# Altium schematic sheet LT5512.SchDoc
size A2; SheetNumber: 1; SheetTotal: 1
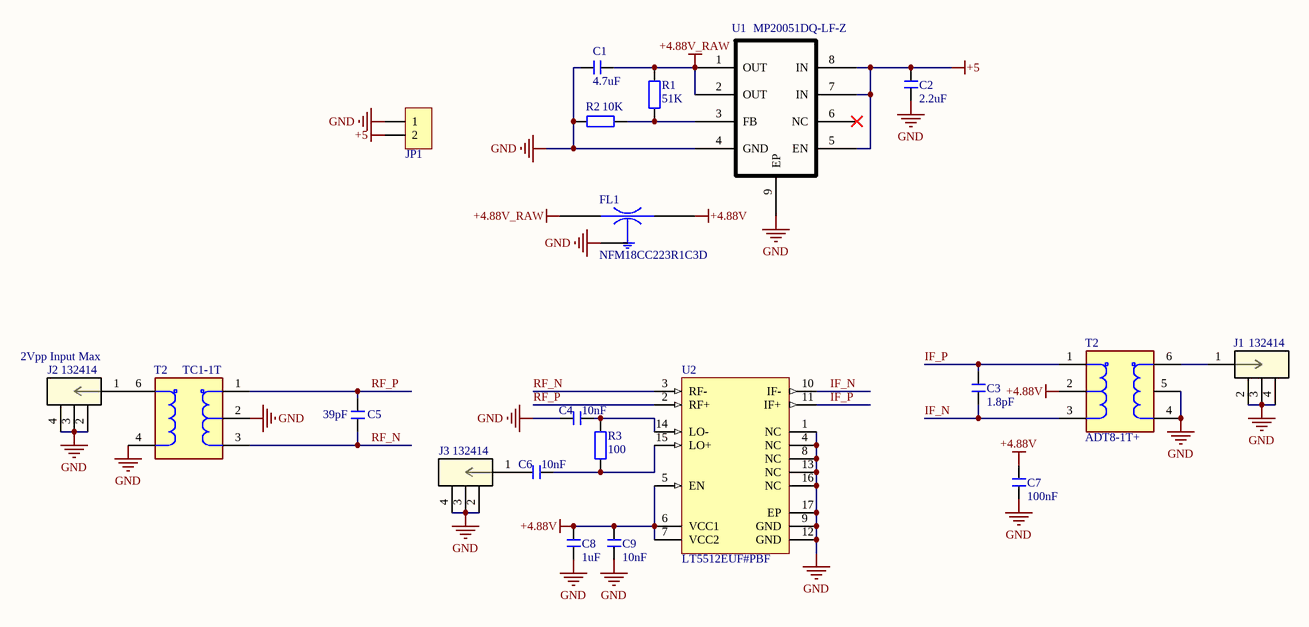
[diagram p0: LT5512.SchDoc]

## Parts
(Parts that share a designator on the sheet are numbered #1, #2 ... from top to bottom, then left to right.)
C1  4.7uF  [C 0603_L]
C2  2.2uF  [C 0603_L]
C3  1.8pF  [C 0402_L]
C4  10nF  [C 0402_L]
C5  39pF  [C 0402_L]
C6  10nF  [C 0402_L]
C7  100nF  [C 0402_L]
C8  1uF  [C 0603_L]
C9  10nF  [C 0402_L]
FL1  NFM18CC223R1C3D  [FIL_NFM18CC223R1C3D]
J1  132414  [CONN_132414_AMP]
J2  132414  [CONN_132414_AMP]
J3  132414  [CONN_132414_AMP]
JP1  HDR-1X2  [KF2510-LI-2P]  (value not drawn)
R1  51K  [R 0603_L]
R2  10K  [R 0603_L]
R3  100  [R 0402_L]
T2#1  TC1-1T  [FP-TC1-1-13M+-MFG]
T2#2  ADT8-1T+  [ADT8-1T+]
U1  MP20051DQ-LF-Z  [SOIC127P600X170-9N]
U2  LT5512EUF#PBF  [LT-UF-16_L]

## Nets
+4.88V: C7.1 C8.2 C9.2 FL1.3 T2#2.2(SECONDARY) U2.5(EN) U2.6(VCC1) U2.7(VCC2)
+4.88V_RAW: C1.2 FL1.1 R1.2 U1.1(OUT) U1.2(OUT)
+5: C2.2 JP1.2 U1.5(EN) U1.7(IN) U1.8(IN)
GND: C1.1 C2.1 C4.1 C7.2 C8.1 C9.1 FL1.2(GND) J1.2 J1.3 J1.4 J2.2 J2.3 J2.4 J3.2 J3.3 J3.4 JP1.1 R2.1 T2#1.2(SECONDARY) T2#1.4(PRIMARY) T2#2.4(PRIMARY) U1.4(GND) U1.9(EP) U2.1(NC) U2.4(NC) U2.8(NC) U2.9(GND) U2.12(GND) U2.13(NC) U2.16(NC) U2.17(EP)
IF_N: C3.1 T2#2.3(SECONDARY_MID) U2.10(IF-)
IF_P: C3.2 T2#2.1(SECONDARY_DOT) U2.11(IF+)
RF_N: C5.1 T2#1.3 U2.3(RF-)
RF_P: C5.2 T2#1.1(SECONDARY_DOT) U2.2(RF+)
NetC4_2: C4.2 R3.2 U2.14(LO-)
NetC6_1: C6.1 J3.1
NetC6_2: C6.2 R3.1 U2.15(LO+)
NetJ1_1: J1.1 T2#2.6(PRIMARY_DOT)
NetJ2_1: J2.1 T2#1.6(PRIMARY_DOT)
NetR1_1: R1.1 R2.2 U1.3(FB)

Not connected (* = marked no-connect by the designer): T2#2 5(NC); U1 6(NC)*

## Notes on the sheet
- (near J2) 2Vpp Input Max

## Library data of the parts
C1-C9 = C: 贴片电容; 淘宝ID: 小糖豆的小窝窝; BOM名称: 贴片电容; 下单链接: https://item.taobao.com/item.htm?ft=t&id=613637044352
FL1 = NFM18CC223R1C3D: SMD Capacitor with Capacitance: 22000pF Tol. 20%. Rated Voltage: 16Vdc; MF: Murata; MP: NFM18CC223R1C3D; SnapEDA_Link: https://www.snapeda.com/parts/NFM18CC223R1C3D/Murata/view-part/?ref=snap; Availability: In Stock; Package: NONSTANDARD; Check_prices: https://www.snapeda.com/parts/NFM18CC223R1C3D/Murata/view-part/?ref=eda; Value: *; Purchase-URL: https://pricing.snapeda.com/search/part/NFM18CC223R1C3D/?ref=eda; Price: None
J1-J3 = 132414: No Description Available; Mfr_Name: Amphenol ICC; Copyright: Copyright (C) 2022 Ultra Librarian. All rights reserved.; Manufacturer_Part_Number: 132414; RefDes: RefDes; Type: DEV
JP1 = Header 2: 2P接插件; 淘宝ID: 小糖豆的小窝窝; BOM名称: 2P接插件; 下单链接: https://item.taobao.com/item.htm?ft=t&id=613637044352
R1-R3 = R: 贴片电阻; 淘宝ID: 小糖豆的小窝窝; BOM名称: 贴片电阻; 下单链接: https://item.taobao.com/item.htm?ft=t&id=613637044352
T2#1 = CMP-00025-00004-3: RF Transformer 1: 1 5 Terminal SMD; RoHS Compliant: No
T2#2 = CMP-00025-00008-6: RF Transformer, 50 ohm, 8.0: 1, 0.10-130 MHz, SMT; RoHS Compliant: Yes
U1 = MP20051DQ-LF-Z: Low Noise, High PSRR, 1A Linear Regulator
U2 = LT5512EUF: High Signal Level Active Mixer, 4.5 to 5.25 V, -40 to 85 degC, 16-Pin QFN (UF), RoHS, Tube; Generic Part Number: LT5512; Supply Voltage Max: 5.25 V; Frequency: 1000 Hz; Supply Voltage Min: 4.5 V; PackageDescription: 16-Pin Plastic Quad Flat No-lead Package, Body 4 x 4 mm, Pitch 0.65 mm; DatasheetVersion: Rev. A; ComponentLink3Description: Package Specification; ComponentLink1URL: http://www.linear.com/; PackageVersion: 06/2010; ComponentLink3URL: http://cds.linear.com/docs/en/packaging/QFN_16_05-08-1692.pdf; Code_JEDEC: MO-220; Mounting Technology: Surface Mount; RoHS: TRUE; Packing: Tube; ComponentLink2Description: Datasheet; Temperature Min: -40 degC; ComponentLink1Description: Manufacturer URL; Temperature Max: 85 degC; PartNumber: LT5512EUF#PBF; ComponentLink2URL: http://cds.linear.com/docs/en/datasheet/5512fa.pdf